# Altium schematic sheet USB.SchDoc
size A4
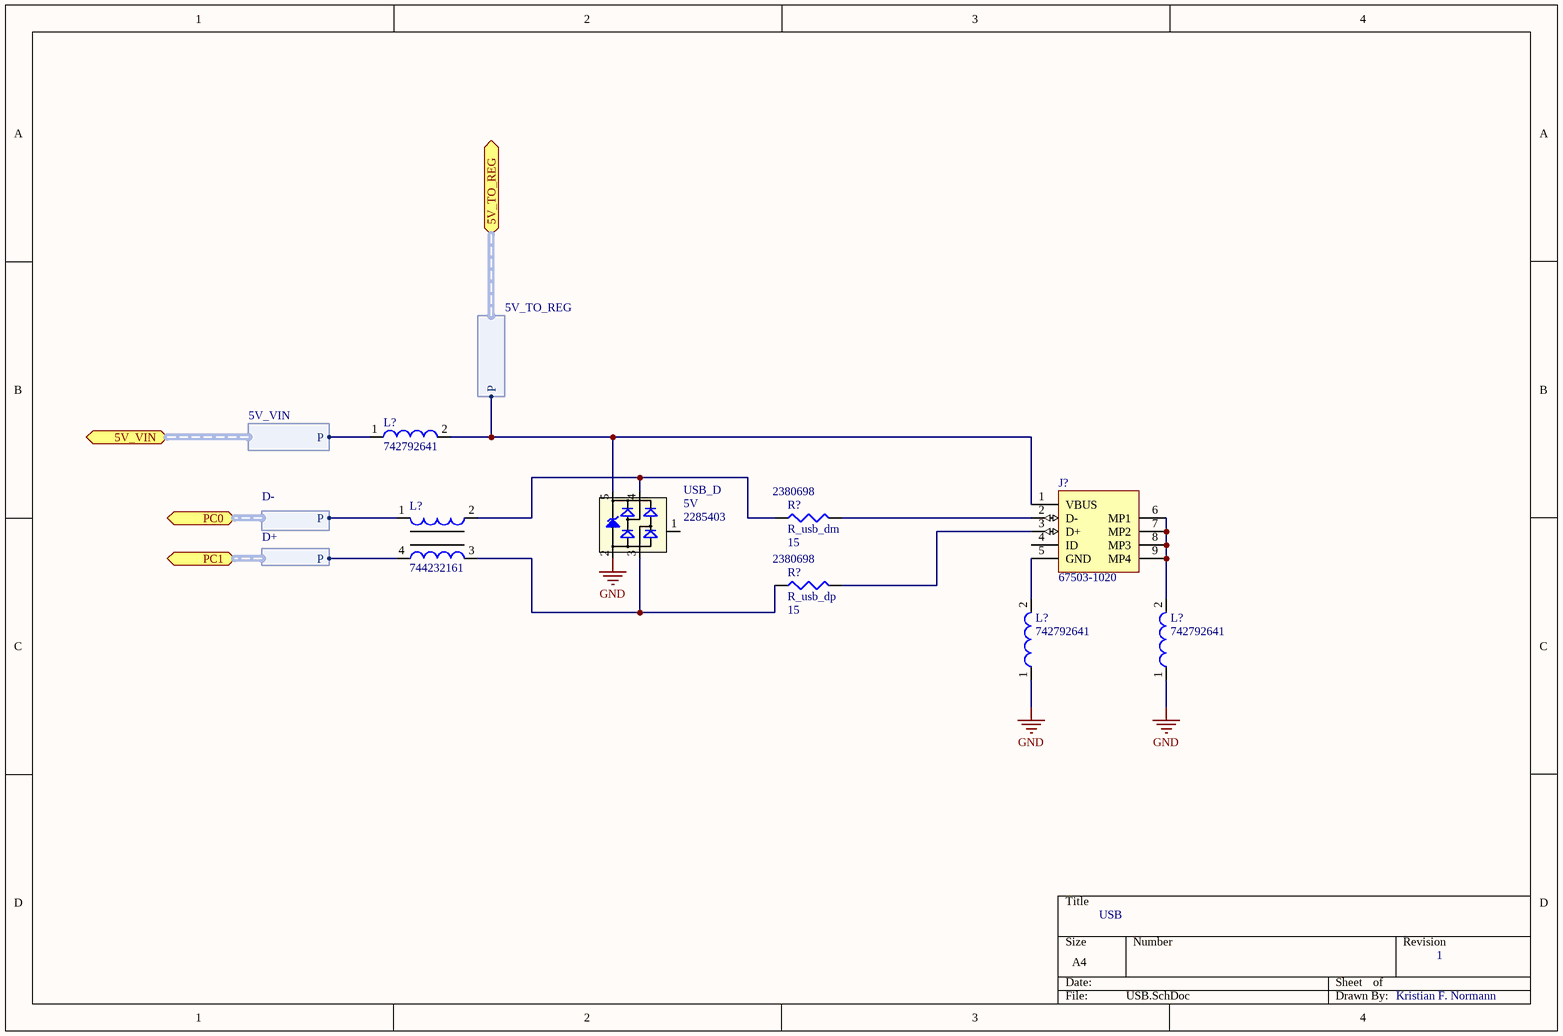
[diagram p0: USB.SchDoc]

## Parts
(Parts that share a designator on the sheet are numbered #1, #2 ... from top to bottom, then left to right.)
J?  67503-1020  [MOLX-67503-1020_V]
L?#1  742792641  [SMD-0603]
L?#2  744232161  [WE-CNSW-1206]
L?#3  742792641  [SMD-0603]
L?#4  742792641  [SMD-0603]
R?#1  R_usb_dm  value 15  Supplier Part Number 1: 2380698  [14-1210]
R?#2  R_usb_dp  value 15  Supplier Part Number 1: 2380698  [14-1210]
USB_D  5V  Supplier Part Number 1: 2285403  [SOT95P275X140-5N]

## Ports
5V_TO_REG (harness 5V_TO_REG), 5V_VIN (harness 5V_VIN), PC0 (harness D-), PC1 (harness D+)

## Harnesses
5V_VIN: P
D-: P
D+: P
5V_TO_REG: P

## Nets
GND: L?#3.1 L?#4.1 USB_D.2(GND)
NetJ?_1: J?.1(VBUS) L?#1.2 USB_D.5(VDD) ; port 5V_TO_REG.P
NetJ?_2: J?.2(D-) R?#1.2
NetJ?_3: J?.3(D+) R?#2.2
NetJ?_5: J?.5(GND) L?#3.2
NetJ?_6: J?.6(MP1) J?.7(MP2) J?.8(MP3) J?.9(MP4) L?#4.2
NetL?#1_1: L?#1.1 ; port 5V_VIN.P
NetL?#2_1: L?#2.1 ; port PC0.P
NetL?#2_2: L?#2.2 R?#1.1 USB_D.4(I/O2)
NetL?#2_3: L?#2.3 R?#2.1 USB_D.3(I/O1)
NetL?#2_4: L?#2.4 ; port PC1.P

Not connected (* = marked no-connect by the designer): J? 4(ID); USB_D 1(NC)

## Notes on the sheet
- USB
- 1
- Kristian F. Normann

## Library data of the parts
J? = CMP-0411-00002-1: USB, MINI, SMD, RA KME04-USBMU03A01; Manufacturer: Molex; ComponentLink1URL: http://www.molex.com/; PartNumber: 67503-1020; Mounting Technology: Surface Mount; ComponentLink1Description: Manufacturer URL; Terminal Pitch: 0.8 mm; DatasheetVersion: Rev F, 06/2009; ComponentLink2Description: Datasheet; PackageDescription: Mini USB Connector, SMT, Righer Angle; ComponentLink2URL: http://www.molex.com/pdm_docs/sd/675031020_sd.pdf; PackageReference: 67503-1020
L?#1 L?#3 L?#4 = CMP-0220-00171-1: SMD EMI Suppression Ferrite Bead WE-CBF, Z = 300 Ohm; Impedance: 300 Ohm; PackageReference: SMD-0603; PackageVersion: 2009; ComponentLink2Description: Datasheet; ComponentLink2URL: http://www.we-online.de/katalog/media/pdf/742792641.pdf; ComponentLink1Description: Manufacturer Link; ComponentLink1URL: http://www.we-online.com; DatasheetVersion: Dec-2005; PackageDescription: Chip Inductor, 2-Leads, Body 1.6 x 0.8 mm
L?#2 = CMP-0222-00033-1: SMD Common Mode Noise Suppressor WE-CNSW, Z = 160 Ohm; Impedance: 160 Ohm; ComponentLink1Description: Manufacturer Link; DatasheetVersion: ver 3, Oct-2004; PackageReference: WE-CNSW-1206; PackageDescription: SMD Inductor, 4-Leads, Body 1.8 x 3.4 mm; ComponentLink1URL: http://www.we-online.com; ComponentLink2Description: Datasheet; PackageVersion: 2004; ComponentLink2URL: http://www.we-online.de/katalog/media/pdf/744232161.pdf
R?#1 R?#2 = Res3: Resistor; Manufacturer: PANASONIC; Manufacturer Part Number: ERJU14F15R0U; Product Range: PANASONIC - ERJ Series; Power Rating: 500; Resistance Tolerance: ± 1%; Resistor Case Style: 1210 [3225 Metric]; Resistor Element Material: Thick Film; Temperature Coefficient: ± 100; Voltage Rating: 200; SVHC: No SVHC (16-Dec-2013; Published: 8-Jun-2000; LatestRevisionDate: 29-May-2009; LatestRevisionNote: IPC-7351 Footprint Added.; PackageReference: J1-0603; Publisher: Altium Limited; PackageDescription: Chip Resistor; Supplier 1: Farnell; RoHS: YES; Stock 1: 3740; Pricing 1: 10=1,05, 100=0,951, 500=0,734, 1000=0,589, 5000=0,434 (EUR); Resistance: 15; Packaging: Cut Tape; MSL: -; ComponentLink1URL: http://www.farnell.com/datasheets/1783557.pdf; ComponentLink1Description: http://www.farnell.com/datasheets/1783557.pdf
USB_D = WE-TVS-HS,SOT23-5L,824011: TVS Diode WE-TVS-HS, VRWM=5V; PartNo: 824011; Manufacturer: Würth Elektronik eiSos GmbH; Manufacturer Part Number: DZ5X068D0R; Reverse Stand Off Voltage: 5V; ComponentLink1Description: Manufacturer; ComponentLink1URL: http://www.we-online.de; Created by: Christin Zierenner; Created Date: March 2010; ComponentLink2Description: Datasheet; ComponentLink2URL: http://katalog.we-online.de/kataloge/eisos/media/pdf/824011.pdf; Supplier 1: Farnell; RoHS: YES; Stock 1: 901; Pricing 1: 1=1,2, 25=0,93, 100=0,77, 500=0,74, 1000=0,73, 3000=0,71, 3000=0,639, 40000=0,615 (EUR); ComponentLink3URL: http://www.semicon.panasonic.co.jp/ds4/DZ5X068D_BED.pdf; ComponentLink3Description: http://www.semicon.panasonic.co.jp/ds4/DZ5X068D_BED.pdf